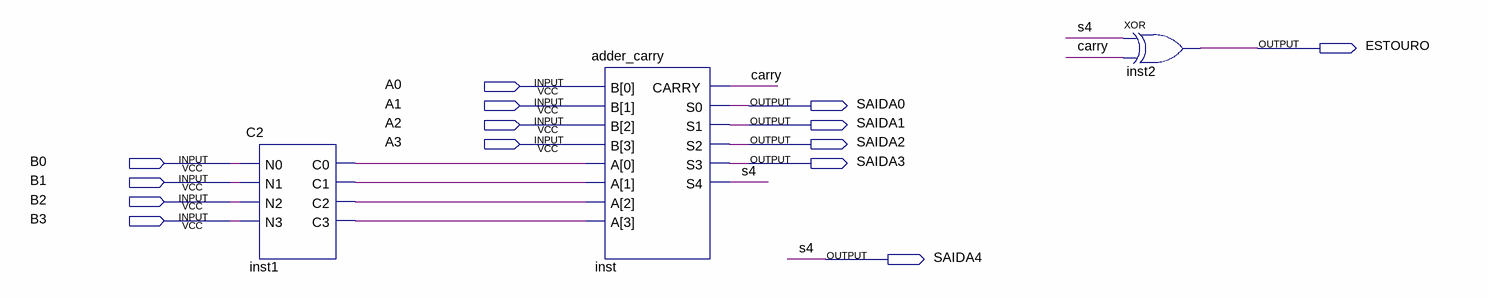
[diagram p0: schematic sheet]
// Quartus schematic sub.bdf as structural Verilog: 3 symbols, 14 pins
module sub (
  input  A0,
  input  A1,
  input  A2,
  input  A3,
  input  B0,
  input  B1,
  input  B2,
  input  B3,
  output ESTOURO,
  output SAIDA0,
  output SAIDA1,
  output SAIDA2,
  output SAIDA3,
  output SAIDA4
);

  wire carry, inst1_c0, inst1_c1, inst1_c2, inst1_c3;

  C2 inst1 (.N0(B0), .N1(B1), .N2(B2), .N3(B3), .C0(inst1_c0), .C1(inst1_c1), .C2(inst1_c2), .C3(inst1_c3));
  adder_carry inst (
    .B({A3, A2, A1, A0}), .A({inst1_c3, inst1_c2, inst1_c1, inst1_c0}), .CARRY(carry), .S0(SAIDA0),
    .S1(SAIDA1), .S2(SAIDA2), .S3(SAIDA3), .S4(SAIDA4));
  xor inst2 (ESTOURO, SAIDA4, carry);

  // Other names for the same wires on the sheet: s4 = SAIDA4
endmodule
